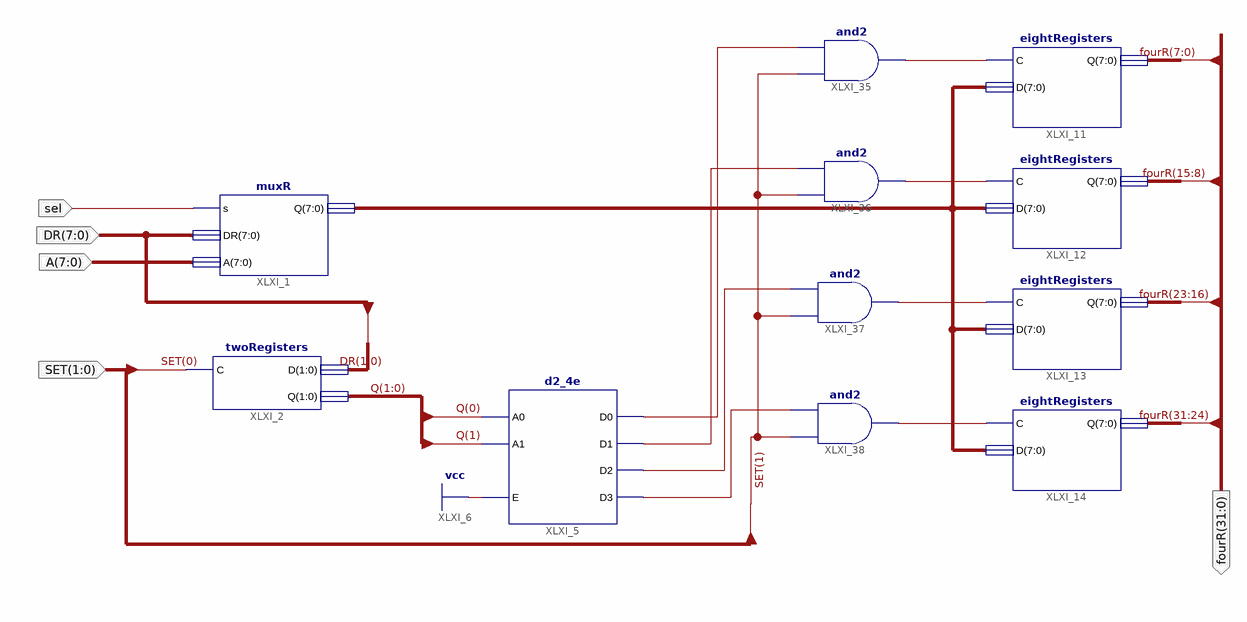
[diagram p0: schematic sheet 1]
// Xilinx ISE schematic fourR.sch (spartan3e) as structural Verilog: 11 symbols, 5 ports
module fourR (
  input  [7:0] DR,
  input  [7:0] A,
  input  [1:0] SET,
  input  sel,
  output [31:0] fourR
);

  wire XLXN_28, XLXN_29, XLXN_30, XLXN_31, XLXN_36, XLXN_37, XLXN_38, XLXN_39;
  wire [1:0] Q;
  wire [7:0] XLXN_19;

  muxR XLXI_1 (.s(sel), .DR(DR), .A(A), .Q(XLXN_19));
  twoRegisters XLXI_2 (.D(DR[1:0]), .C(SET[0]), .Q(Q));
  d2_4e XLXI_5 (.A0(Q[0]), .A1(Q[1]), .E(1'b1), .D0(XLXN_36), .D1(XLXN_37), .D2(XLXN_38), .D3(XLXN_39));
  eightRegisters XLXI_11 (.C(XLXN_28), .D(XLXN_19), .Q(fourR[7:0]));
  eightRegisters XLXI_12 (.C(XLXN_29), .D(XLXN_19), .Q(fourR[15:8]));
  eightRegisters XLXI_13 (.C(XLXN_30), .D(XLXN_19), .Q(fourR[23:16]));
  eightRegisters XLXI_14 (.C(XLXN_31), .D(XLXN_19), .Q(fourR[31:24]));
  and XLXI_35 (XLXN_28, SET[1], XLXN_36);
  and XLXI_36 (XLXN_29, SET[1], XLXN_37);
  and XLXI_37 (XLXN_30, SET[1], XLXN_38);
  and XLXI_38 (XLXN_31, SET[1], XLXN_39);
endmodule
